# EAGLE design Adafruit 2.7in Tri-Color eInk Display (EAGLE 9.2.0)
COMPANY: ADAFRUIT INDUSTRIES; DRAWN: K. TOWNSEND; REV: A
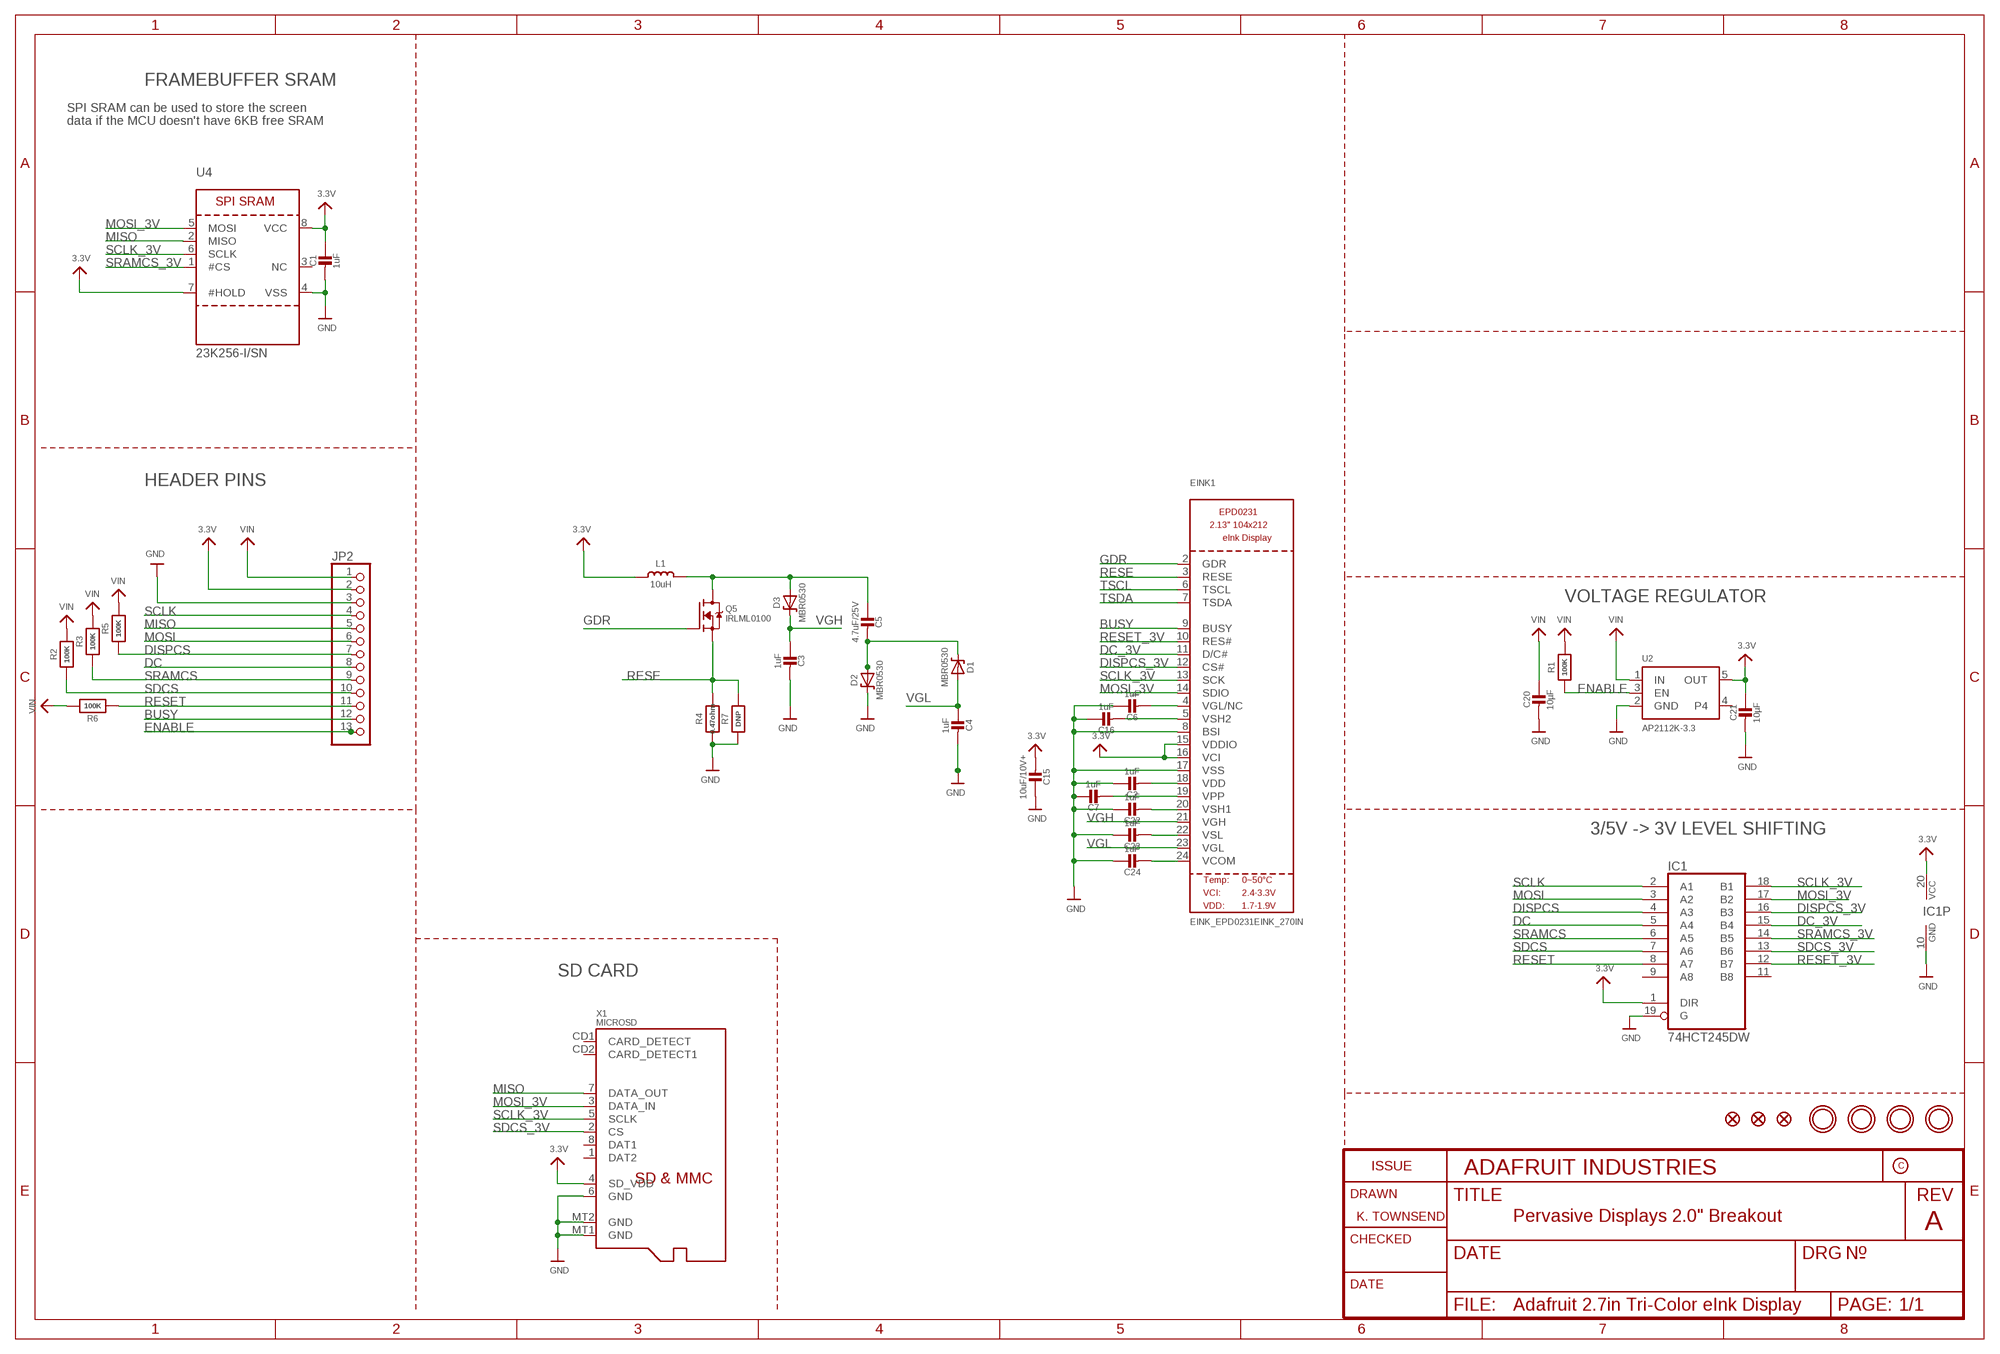
[diagram p0: schematic, sheet 1]

## Parts
C1  1uF  CAP_CERAMIC0805_10MGAP  [0805_10MGAP]
C2  1uF  CAP_CERAMIC0805-NOOUTLINE  [0805-NO]
C3  1uF  CAP_CERAMIC0805-NOOUTLINE  [0805-NO]
C4  1uF  CAP_CERAMIC0805-NOOUTLINE  [0805-NO]
C5  4.7uF/25V  CAP_CERAMIC0805-NOOUTLINE  [0805-NO]
C6  1uF  CAP_CERAMIC0805-NOOUTLINE  [0805-NO]
C7  1uF  CAP_CERAMIC0805-NOOUTLINE  [0805-NO]
C15  10uF/10V+  CAP_CERAMIC0805-NOOUTLINE  [0805-NO]
C16  1uF  CAP_CERAMIC0805-NOOUTLINE  [0805-NO]
C20  10µF  CAP_CERAMIC0805-NOOUTLINE  [0805-NO]
C21  10µF  CAP_CERAMIC0805-NOOUTLINE  [0805-NO]
C22  1uF  CAP_CERAMIC0805-NOOUTLINE  [0805-NO]
C23  1uF  CAP_CERAMIC0805-NOOUTLINE  [0805-NO]
C24  1uF  CAP_CERAMIC0805-NOOUTLINE  [0805-NO]
D1  MBR0530  DIODE-SCHOTTKYSOD-123  [SOD-123]
D2  MBR0530  DIODE-SCHOTTKYSOD-123  [SOD-123]
D3  MBR0530  DIODE-SCHOTTKYSOD-123  [SOD-123]
EINK1  EINK_EPD0231EINK_270IN  [EINK_270IN]
FID1  FIDUCIAL_1MM  [FIDUCIAL_1MM]
FID2  FIDUCIAL_1MM  [FIDUCIAL_1MM]
FID3  FIDUCIAL_1MM  [FIDUCIAL_1MM]
IC1  74HCT245DW  [SO20W]
JP2  HEADER-1X13  [1X13_ROUND_70]
L1  10uH  INDUCTORNR401  [INDUCTOR_4X4MM_NR401]
Q5  IRLML0100  IRLML2060TRPBF  [SOT23-3]
R1  100K  RESISTOR0805_NOOUTLINE  [0805-NO]
R2  100K  RESISTOR0805_NOOUTLINE  [0805-NO]
R3  100K  RESISTOR0805_NOOUTLINE  [0805-NO]
R4  0.47ohm  RESISTOR0805_10MGAP  [0805_10MGAP]
R5  100K  RESISTOR0805_NOOUTLINE  [0805-NO]
R6  100K  RESISTOR0805_NOOUTLINE  [0805-NO]
R7  DNP  RESISTOR0805_10MGAP  [0805_10MGAP]
U2  AP2112K-3.3  VREG_SOT23-5  [SOT23-5]
U4  23K256-I/SN  SRAM_SPI_SOIC8  [SOIC8_150MIL]
U$3  MOUNTINGHOLE2.5  [MOUNTINGHOLE_2.5_PLATED]
U$4  MOUNTINGHOLE2.5  [MOUNTINGHOLE_2.5_PLATED]
U$5  MOUNTINGHOLE2.5  [MOUNTINGHOLE_2.5_PLATED]
U$6  MOUNTINGHOLE2.5  [MOUNTINGHOLE_2.5_PLATED]
X1  MICROSD  [MICROSD]

## Nets
3.3V: C1.1 C15.2 C21.1 EINK1.15(VDDIO) EINK1.16(VCI) IC1.1(DIR) IC1.20(VCC) JP2.2 L1.P$2 U2.5(OUT) U4.7(#HOLD) U4.8(VCC) X1.4(SD_VDD)
BUSY: EINK1.9(BUSY) JP2.12
DC: IC1.5(A4) JP2.8
DC_3V: EINK1.11(D/C#) IC1.15(B4)
DISPCS: IC1.4(A3) JP2.7 R5.1
DISPCS_3V: EINK1.12(CS#) IC1.16(B3)
ENABLE: JP2.13 R1.1 U2.3(EN)
GDR: EINK1.2(GDR) Q5.1(G)
GND: C1.2 C2.1 C3.2 C4.2 C6.1 C7.1 C15.1 C16.1 C20.2 C21.2 C22.1 C23.1 C24.1 D2.C EINK1.8(BSI) EINK1.17(VSS) IC1.10(GND) IC1.19(G) JP2.3 R4.2 R7.2 U2.2(GND) U4.4(VSS) X1.6(GND) X1.MT1(GND) X1.MT2(GND)
MISO: JP2.5 U4.2(MISO) X1.7(DATA_OUT)
MOSI: IC1.3(A2) JP2.6
MOSI_3V: EINK1.14(SDIO) IC1.17(B2) U4.5(MOSI) X1.3(DATA_IN)
N$1: C7.2 EINK1.19(VPP)
N$2: C5.2 D1.C D2.A
N$3: C5.1 D3.A L1.P$1 Q5.3(D)
N$4: C16.2 EINK1.5(VSH2)
N$5: C2.2 EINK1.18(VDD)
N$6: C22.2 EINK1.20(VSH1)
N$9: C6.2 EINK1.4(VGL/NC)
N$27: C23.2 EINK1.22(VSL)
N$33: C24.2 EINK1.24(VCOM)
RESE: EINK1.3(RESE) Q5.2(S) R4.1 R7.1
RESET: IC1.8(A7) JP2.11 R6.1
RESET_3V: EINK1.10(RES#) IC1.12(B7)
SCLK: IC1.2(A1) JP2.4
SCLK_3V: EINK1.13(SCK) IC1.18(B1) U4.6(SCLK) X1.5(SCLK)
SDCS: IC1.7(A6) JP2.10 R2.1
SDCS_3V: IC1.13(B6) X1.2(CS)
SRAMCS: IC1.6(A5) JP2.9 R3.1
SRAMCS_3V: IC1.14(B5) U4.1(#CS)
TSCL: EINK1.6(TSCL)
TSDA: EINK1.7(TSDA)
VGH: C3.1 D3.C EINK1.21(VGH)
VGL: C4.1 D1.A EINK1.23(VGL)
VIN: C20.1 JP2.1 R1.2 R2.2 R3.2 R5.2 R6.2 U2.1(IN)
Unconnected: IC1.9(A8) IC1.11(B8) U2.4 U4.3(NC) X1.1(DAT2) X1.8(DAT1) X1.CD1(CARD_DETECT) X1.CD2(CARD_DETECT1)

## Notes on the sheet
- FRAMEBUFFER SRAM
- SPI SRAM can be used to store the screen
- data if the MCU doesn't have 6KB free SRAM
- HEADER PINS
- VOLTAGE REGULATOR
- 3/5V -> 3V LEVEL SHIFTING
- SD CARD
- Pervasive Displays 2.0" Breakout

## Library data of the parts
C1-C7 C15 C16 C20-C24 = microbuilder:CAP_CERAMIC: Ceramic Capacitors For new designs, use the packages preceded by an '_' character since they are more reliable: The following footprints should be used on most boards: _0402 - Standard footprint for regular board layouts _0603 - Standard footprint for regular board layouts _0805 - Standard footprint for regular board layouts _1206 - Standard footprint for regular board layouts For extremely tight-pitch boards where space is at a premium, the following 'micro-pitch' footprints can be used (smaller pads, no silkscreen outline, etc.): _0402MP - Micro-pitch footprint for very dense/compact boards _0603MP - Micro-pitch footprint for very dense/compact boards _0805MP - Micro-pitch footprint for very dense/compact boards _1206MP - Micro-pitch footprint for very dense/compact boards
D1-D3 = microbuilder:DIODE-SCHOTTKY
EINK1 = microbuilder:EINK_EPD0231
FID1-FID3 = microbuilder:FIDUCIAL: Fiducial Alignment Points Various fiducial points for machine vision alignment.; BOM: EXCLUDE
IC1 = 74xx-eu:74*245: Octal BUS TRANSCEIVER, 3-state
JP2 = microbuilder:HEADER-1X13
L1 = microbuilder:INDUCTOR: Inductors 0603: 10nH Ceramic Inductor - microwire antenna/RF (Digikey: 712-1434-2-ND) 0805: 560nH Ceramic Inductor - RF (Digikey: 553-1047-1-ND) 270nH Ceramic Inductor - Q = 40@250MHz, +-5%, 1 Ohm DC Resistance (Digikey: 535-10506-2-ND) 1007 (2518 Metric) SMT: 10µH 10% 250mOhm 820mA 1007 Inductor (Digikey: 587-2189-1-ND) 22µH 10% 500mOhm 580mA 1007 Inductor (Digikey: 587-2190-1-ND) 47µH 10% 950mOhm 420mA 1007 Inductor (Digikey: 587-2191-1-ND) 47µH 5% 100mOhm 1A 1008 Inductor (Digikey: 732-1816-1-ND) 5.0x5.0mm (Taiyo Yuden NR5040 Series) 6.8µH 20% 2.3A 64mOhm Inductor (Digikey: 587-2374-2-ND) 5.0x5.0mm (TDK VLC5045 Series) 4.7µH 20% 3.3A 34mOhm Inductor (Digikey: 445-6526-1-ND) 6.8µH 20% 2.7A 46mOhm Inductor (Digikey: 445-6527-1-ND) 6.0x6.0mm (TDK VLC6045 Series) 4.7µH 20% 3.8A 27mOhm Inductor (Digikey: 445-6538-2-ND) 6.8µH 20% 3A 41mOhm Inductor (Digikey: 445-6540-1-ND) 6.2µH 30% 2.2A 45mOhm Inductor (Digikey: SRR5028-6R2YCT-ND) - Not TDK VLC6045 but footprint should match 6.0x6.0mm (TDK SLF6045 Series) 6.8uH 30% 2A 33mOhm Inductor (Digikey: 445-4572-1-ND, Mouser: 810-SLF645T6R8N2R0PF) 6.0x6.0mm (Sumida CDRH5D28 Series) 6.2uH 30% 1.8A 45mOhm Inductor (Digikey: 308-1542-1-ND) Taiyo Yuden NR3015T2R2M - 2.2uH 20% 1.5A (Digikey: 587-1648-2-ND, Mouser: 963-NR3015T2R2M) - Used with TI TPS62172 CoilCraft RFID Transponder Coil - MA5532-AE (For use with AS3935 Lightning Sensor) Taiyo Yuden NRH2412T2R2MNGH - 2.2uH 20% 1AA (Digikey: 587-3443-1-ND) - Used with TI LM3671 Vishay IHLP 1.0uH Molded Inductor - 24mOhm DCR, 5A, +/-20%, -55°C-125°C (Digikey: 541-1319-1-ND)
Q5 = Parts:IRLML2060TRPBF
R1-R7 = microbuilder:RESISTOR: Resistors For new designs, use the packages preceded by an '_' character since they are more reliable: The following footprints should be used on most boards: _0402 - Standard footprint for regular board layouts _0603 - Standard footprint for regular board layouts _0805 - Standard footprint for regular board layouts _1206 - Standard footprint for regular board layouts For extremely tight-pitch boards where space is at a premium, the following 'micro-pitch' footprints can be used (smaller pads, no silkscreen outline, etc.): _0402MP - Micro-pitch footprint for very dense/compact boards _0603MP - Micro-pitch footprint for very dense/compact boards _0805MP - Micro-pitch footprint for very dense/compact boards _1206MP - Micro-pitch footprint for very dense/compact boards
U2 = microbuilder:VREG_SOT23-5: SOT23-5 Fixed Voltage Regulators Part Current Out V Out V In V Dropout θJA (°C/W) TJ (°C) Digikey Part No. ADP121 150mA 3.3V 3.4-5.5V 0.09V @ 150mA -- -- ADP121-AUJZ33R7CT-ND ADP121 150mA 3.0V 3.1-5.5V 0.09V @ 150mA -- -- ADP121-AUJZ30R7CT-ND ADP122 300mA 3.3V 3.4-5.5V 0.085V @ 300mA -- -- ADP122AUJZ-3.3-R7CT-ND ADP1712 300mA 3.3V 3.5-5.5V 0.17V @ 300mA -- -- ADP1712AUJZ-3.3-R7TR-ND AP7311 (Low Cost) 150mA 3.3V 3.5-6V 0.15V @ 150mA -- -- AP7311-33WG-7DICT-ND LD39015M18R 150mA 1.8V 1.9V-5.5V 0.08V @ 100mA -- -- 497-6977-1-ND LP2985A-33DBVR 150mA 3.3V 3.3-16V 0.28V @ 150mA 206 150 296-18479-1-ND MCP1824T-3302E/OT 300mA 3.3V 3.5V-6V 0.2V @ 300mA -- -- MCP1824T-3302E/OTCT-ND MIC5205-2.5YM5 TR 150mA 2.5V 2.7-16V 0.165V @ 150mA -- -- 576-1257-2-ND MIC5205-3.0YM5 TR 150mA 3.0V 3.2V-16V 0.165V @ 150mA -- -- 576-1258-2-ND MIC5205-3.3YM5 TR 150mA 3.3V 3.5V-16V 0.165V @ 150mA -- -- 576-1259-2-ND TPS780330220 150mA 3.3V+2.2V 3.6-5.5V 250mV Max -- -- 296-23332-1-ND TDA3663/N1,135 100mA 3.3V 3.5-45V 0.18V @ 50mA -- -- 568-5343-1-ND Max operating temp can be calculated using θJA, TJ (max junction temperature), and power in watts. Set the "Maximum Ambient Temperature" until it reaches TJ ("Max Junction Temperature"), which is the absolute limit for safe use of the regulator: Heat Sink Temperature Calculator <http://www.daycounter.com/Calculators/Heat-Sink-Temperature-Calculator.phtml> For example, With 12V source into a 3.3V LP2985 and a 30mA load, we are dissipating (12V-3.3V) * 0.03A = 0.261W. With a θJA of 206 °C/W, a TJ of 150°C, and 261mW we can safely use the chip without a heat sink up to 75°C (=147.1°C Junction Temperature).
U4 = microbuilder:SRAM_SPI_SOIC8: SRAM - 8-Pin SPI Interface 23K640-I/SN - 8KB (64Kb), 20MHz, 2.7-3.6V 23K256-I/SN - 32KB (256Kb), 20MHz, 2.7-3.6V 23LC512-I/SN - 64KB (512Kb), 20MHz, 2.7-3.6V
U$3-U$6 = microbuilder:MOUNTINGHOLE: Mounting Hole For #2 screws (0.086"/2.18mm width, 0.094"/2.4mm hole) use 2.5mm; BOM: EXCLUDE
X1 = microbuilder:MICROSD: MicroSD/Transflash Card Holder with SPI pinout 3M: 2908-05WB-MG 4UConnector: 19656 Footprint courtesy: Adafruit Industries

## Board
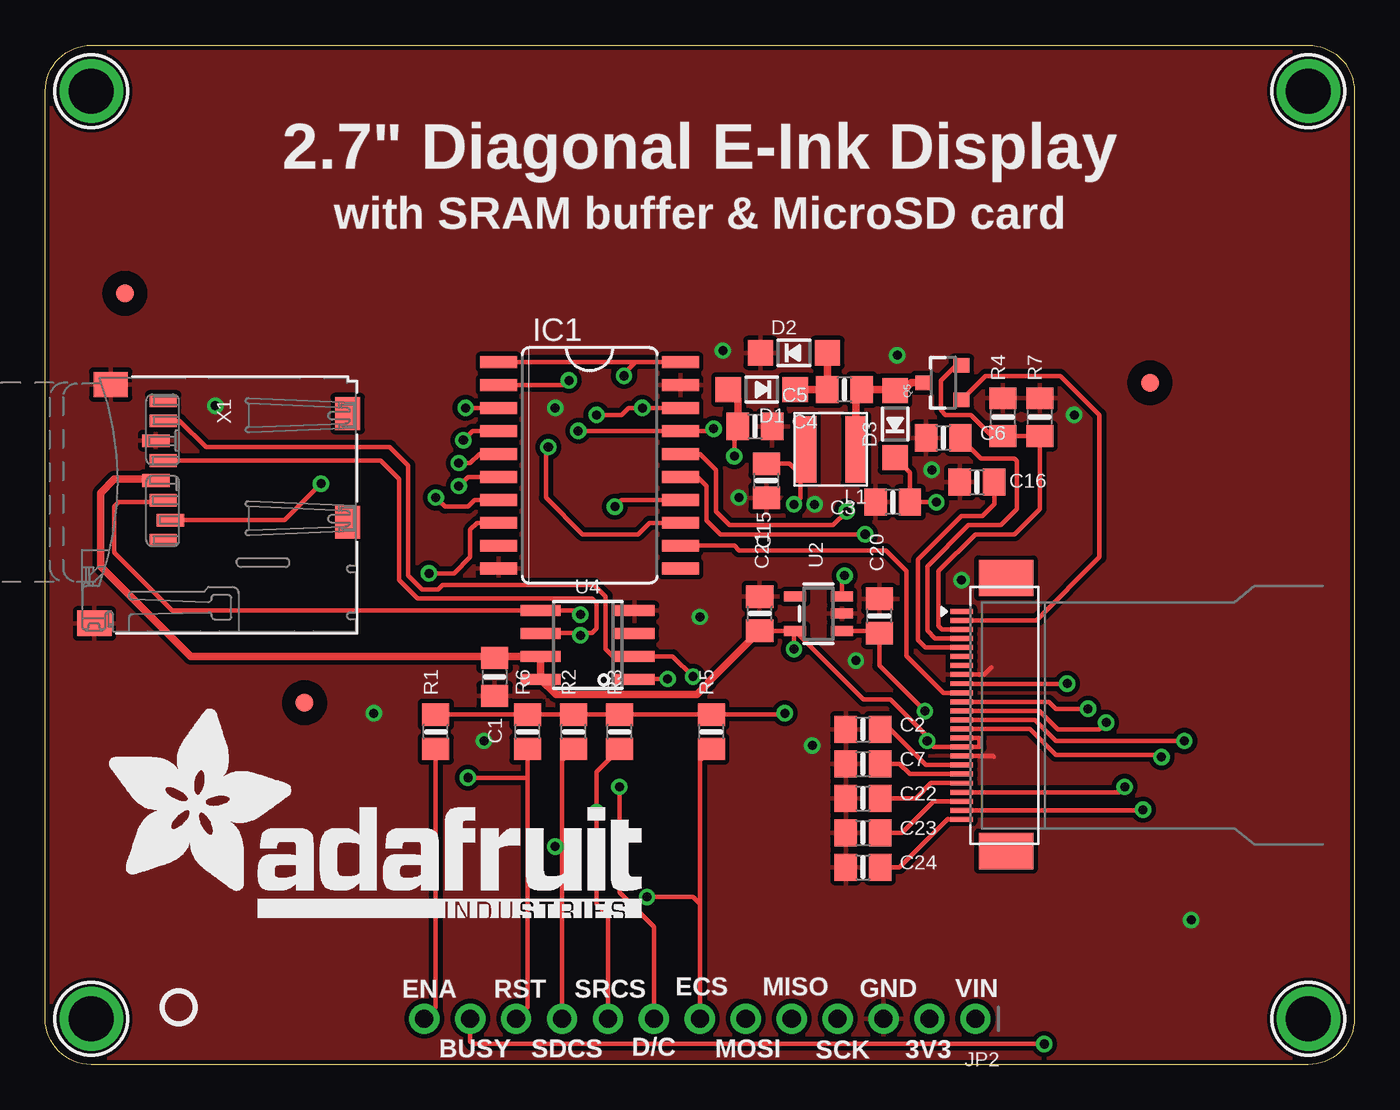
[diagram p1: board, top side]
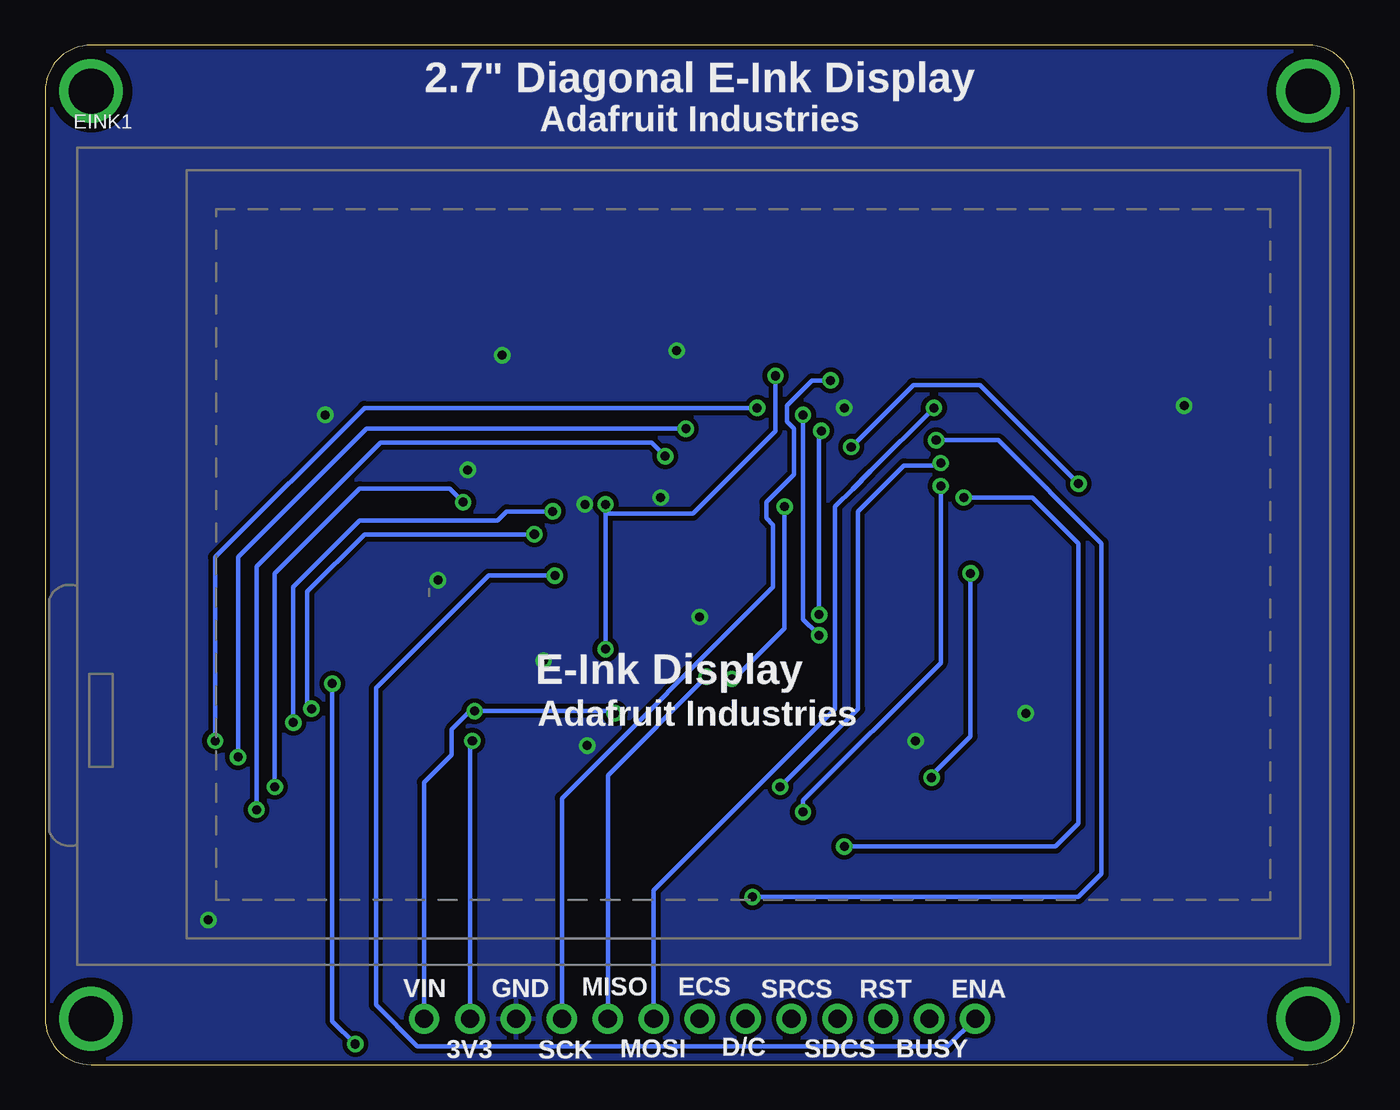
[diagram p2: board, bottom side, seen from below]

Size 72.4 x 56.39 mm. Coordinates in mm from the lower left corner, seen from the top.
Outline: 2.55,56.39 69.86,56.39 arc-90 72.4,53.85 72.4,2.54 arc-90 69.86,0 2.54,0 arc-90 0,2.53 0.01,53.85 arc-90 2.55,56.39
Copper layers (1*16): Top 0.035mm / dielectric 1.5mm / Bottom 0.035mm
Design rules "adafruit *": minimum track width 8mil, minimum drill 15.5mil, track to track 8mil, track to pad 8mil, pad to pad 8mil, via to via 8mil, smd to smd 8mil, copper to edge 10mil, drill to drill 8mil, minimum pad ring 10mil, minimum via ring 8mil, stop-mask expansion 2mil, vias tented up to drill 20mil, thermal gap 10mil

### Footprints (pad centres in the part's own frame; a part is rotated, then mirrored left to right if it is on the bottom)
0805_10MGAP = smd 1.2 x 1.5: 1 -1.05,0; 2 1.05,0
0805-NO = smd 1.24 x 1.5: 1 -0.95,0; 2 0.95,0
SOD-123 = smd 1.4 x 1.4: A 1.85,0; C -1.85,0
EINK_270IN = smd 1.25 x 0.275 bottom: 1 12.26,-22.25; 2 12.26,-22.75; 3 12.26,-23.25; 4 12.26,-23.75; 5 12.26,-24.25; 6 12.26,-24.75; 7 12.26,-25.25; 8 12.26,-25.75; 9 12.26,-26.25; 10 12.26,-26.75; 11 12.26,-27.25; 12 12.26,-27.75; 13 12.26,-28.25; 14 12.26,-28.75; 15 12.26,-29.25; 16 12.26,-29.75; 17 12.26,-30.25; 18 12.26,-30.75; 19 12.26,-31.25; 20 12.26,-31.75; 21 12.26,-32.25; 22 12.26,-32.75; 23 12.26,-33.25; 24 12.26,-33.75 | smd 3 x 2 bottom: SPRT1 9.8,-20.4; SPRT2 9.8,-35.51
FIDUCIAL_1MM = smd 1 x 1: 1 0,0
SO20W = smd 0.66 x 2.032: 1 -5.715,-5.029; 2 -4.445,-5.029; 3 -3.175,-5.029; 4 -1.905,-5.029; 5 -0.635,-5.029; 6 0.635,-5.029; 7 1.905,-5.029; 8 3.175,-5.029; 9 4.445,-5.029; 10 5.715,-5.029; 11 5.715,5.029; 12 4.445,5.029; 13 3.175,5.029; 14 1.905,5.029; 15 0.635,5.029; 16 -0.635,5.029; 17 -1.905,5.029; 18 -3.175,5.029; 19 -4.445,5.029; 20 -5.715,5.029
1X13_ROUND_70 = drill 1 pad 1.676: 1 -15.24,0; 2 -12.7,0; 3 -10.16,0; 4 -7.62,0; 5 -5.08,0; 6 -2.54,0; 7 0,0; 8 2.54,0; 9 5.08,0; 10 7.62,0; 11 10.16,0; 12 12.7,0; 13 15.24,0
INDUCTOR_4X4MM_NR401 = smd 1.2 x 3.7: P$1 -1.4,0; P$2 1.4,0
SOT23-3 = smd 0.8 x 0.9: 1 -0.95,-1; 2 0.95,-1; 3 0,1.1
SOT23-5 = smd 0.55 x 1.2: 1 -0.95,-1.3; 2 0,-1.3; 3 0.95,-1.3; 4 0.95,1.3; 5 -0.95,1.3
SOIC8_150MIL = smd 0.6 x 2.2: 1 -1.905,-2.6; 2 -0.635,-2.6; 3 0.635,-2.6; 4 1.905,-2.6; 5 1.905,2.6; 6 0.635,2.6; 7 -0.635,2.6; 8 -1.905,2.6
MOUNTINGHOLE_2.5_PLATED = drill 2.5 pad 3.2: P$1 0,0
MICROSD = smd 0.7 x 1.5: 1 9,-10.64; 2 7.9,-10.24; 3 6.8,-10.64; 4 5.7,-11.04; 5 4.6,-10.64; 6 3.5,-11.04; 7 2.4,-10.64; 8 1.3,-10.64 | smd 1.8 x 1.4: CD1 2,-0.44; CD2 8,-0.44 | smd 1.4 x 1.9: MT1 0.4,-13.54; MT2 13.6,-14.44

### Placement (x,y rotation side)
C1  24.85,21.44 270 top
C2  45.22,18.54 0 top
C3  46.87,31.11 180 top
C4  39.25,35.31 0 top
C5  44.21,37.34 180 top
C6  49.67,34.67 0 top
C7  45.22,16.64 0 top
C15  39.88,32.3 90 top
C16  51.53,32.22 0 top
C20  46.13,24.82 90 top
C21  39.52,24.94 90 top
C22  45.22,14.73 0 top
C23  45.22,12.83 0 top
C24  45.22,10.92 0 top
D1  39.63,37.34 180 top
D2  41.41,39.37 0 top
D3  47,35.43 90 top
EINK1  62.94,47.32 0 bottom
FID1  4.41,42.66 0 top
FID2  14.35,20.02 90 top
FID3  61.1,37.72 0 top
IC1  30.11,33.15 270 top
JP2  36.21,2.54 180 top
L1  43.44,34.04 180 top
Q5  49.67,37.72 90 top
R1  21.6,18.41 90 top
R2  29.22,18.41 90 top
R3  31.76,18.41 90 top
R4  52.97,35.81 90 top
R5  36.84,18.41 90 top
R6  26.68,18.41 90 top
R7  55,35.81 90 top
U2  42.76,24.94 90 top
U4  30,23.22 90 top
U$3  69.86,2.54 0 top
U$4  2.55,2.54 0 top
U$5  69.86,53.85 0 top
U$6  2.55,53.85 0 top
U$9  [PCBFEAT-REV-040]  7.38,3.17 0 top
U$39  [ADAFRUIT_TEXT_30MM]  3.31,8.13 0 top
X1  17.16,38.01 270 top

### Tracks (layer width: path | path; a pad name or v marks a point on that pad's centre or on a via)
3.3V  (via drill 0.5)
  Top 0.254: 32.65,38.86 IC1.1 | IC1.20 32.65,38.86 | C15.2 41.15,33.25 41.76,32.64 41.76,31.34 v41.41,30.99 | U2.5 C21.1 | U2.5 39.53,23.99 | U2.5 45.26,20.19 46.75,20.19 48.78,18.16 v48.78,17.91 49.11,17.57 EINK1.16 51.68,17.57 51.68,18.06 51.67,18.07 EINK1.15 | v41.41,22.99 41.41,23.94 U2.5 | 32.65,38.86 32.01,38.23 v32.01,38.1 | C1.1 24.85,22.59
  Top 0.406: L1.P$2 41.76,33.75 41.76,32.64 | U4.7 27.39,22.59 | 24.85,22.59 C1.1 | 24.85,22.59 8.03,22.59 3.06,27.56 3.06,31.62 3.82,32.38 6.05,32.38 X1.4 | C21.1 36.68,21.16 36.68,21.11 36.05,20.48 28.24,20.48 U4.8 U4.7 | U4.7 24.85,22.59
  Bottom 0.254: v41.41,30.99 41.41,30.48 | 41.41,30.48 v41.41,22.99 | v32.01,38.1 32.01,35.05 36.59,30.48 41.41,30.48 | JP2.2 48.91,17.78 v48.78,17.91
BUSY  (via drill 0.5)
  Top 0.254: v55.26,1.14 23.63,1.14 23.51,1.27 JP2.12 | EINK1.9 56.52,21.07 v56.53,21.08
  Bottom 0.254: v56.53,21.08 56.53,2.41 v55.26,1.14
DC  (via drill 0.5)
  Top 0.254: IC1.5 24.01,33.78 23.51,33.27 v22.87,33.27 | v31.76,15.37 31.76,9.53 33.67,7.62 JP2.8
  Bottom 0.254: 23,33.27 v22.87,33.27 23,33.15 24.9,33.15 27.44,30.61 27.44,19.68 v31.76,15.37
DC_3V  (via drill 0.5)
  Top 0.254: v57.67,19.68 55.89,19.68 55.5,20.07 EINK1.11 | v45.35,29.34 37.35,29.34 36.59,30.1 36.59,32 36.08,32.51 IC1.15
  Bottom 0.254: v45.35,29.34 54.75,29.34 57.92,26.16 57.92,19.94 v57.67,19.68
DISPCS  (via drill 0.5)
  Top 0.254: IC1.4 23.63,35.05 v23.12,34.54 | R5.1 36.21,16.83 36.21,8.89 | 36.21,8.89 JP2.7 | 36.21,8.89 35.82,9.27 v33.28,9.27
  Bottom 0.254: 23.25,34.54 v23.12,34.54 19.7,34.54 13.98,28.83 13.98,10.54 15.25,9.27 v33.28,9.27
DISPCS_3V  (via drill 0.5)
  Top 0.254: IC1.16 36.21,33.78 37.09,32.89 37.09,30.61 37.86,29.84 43.57,29.84 v44.33,30.61 | v58.68,18.92 58.3,18.54 56.02,18.54 54.99,19.57 EINK1.12
  Bottom 0.254: v58.68,18.92 58.68,26.42 55,30.1 47.38,30.1 46.87,30.61 v44.33,30.61
ENABLE  (via drill 0.5)
  Top 0.254: v44.21,27.05 44.06,26.91 U2.3 | R1.1 21.6,3.17 JP2.13
  Bottom 0.254: JP2.13 22.49,1.02 51.83,1.02 54.11,3.3 54.11,20.83 47.89,27.05 v44.21,27.05
GDR
  Top 0.254: Q5.1 52,38.1 56.14,38.1 58.3,35.94 58.3,28.07 54.81,24.57 52.08,24.57 51.68,24.57 EINK1.2
GND  (via drill 0.5)
  Top 0.254: 52.33,21.97 51.94,21.57 EINK1.8 | 52.46,17.02 52.41,17.07 EINK1.17
  other vias: 37.48,39.5 47.13,39.24 36.21,24.77 44.84,22.35 50.68,26.8 38.36,31.37 49.03,32.89 42.43,17.65 18.17,19.43 9.41,36.45 63.38,8 24.27,17.91 28.2,36.32 42.56,30.99 56.91,35.94
  pour Top (isolate 0.254): 0.01,56.64 72.4,56.64 72.4,0 0.01,0
  pour Bottom (isolate 0.254): 0.01,56.64 72.4,56.64 72.4,0 0.01,0
MISO  (via drill 0.5)
  Top 0.254: X1.7 7.45,35.61 8.9,34.16 19.06,34.16 20.08,33.15 20.08,27.05 20.84,26.29 21.73,26.29 21.98,26.54 30.36,26.54 31,25.91 31,22.99 31.4,22.59 U4.2 34.7,22.59 v35.82,21.46
  Bottom 0.254: JP2.5 41.29,16 v35.82,21.46
MOSI  (via drill 0.5)
  Top 0.254: IC1.3 v23.25,36.32
  Bottom 0.254: 26.81,32.77 v23.25,36.32 | 27.7,31.88 28.71,30.86 28.71,19.68 38.75,9.65 JP2.6
  Bottom 0.305: 27.7,31.88 26.81,32.77
MOSI_3V  (via drill 0.5)
  Top 0.254: v36.97,35.18 36.84,35.05 IC1.17 v29.47,35.05 | v61.73,17.02 61.61,17.14 55.89,17.14 54.46,18.57 EINK1.14 | v29.6,24.89 29.37,25.12 U4.5 7.02,25.12 3.82,28.32 3.82,30.86 4.07,31.11 6.43,31.11 X1.3 | EINK1.14
  Bottom 0.254: v36.97,35.18 54.62,35.18 61.73,28.07 v61.73,17.02 | v29.6,24.89 29.6,34.92 v29.47,35.05
N$1
  Top 0.254: C7.2 47.25,16.64 47.82,16.07 49.54,16.07 49.77,16.07 EINK1.19
N$2
  Top 0.406: D2.A C5.2 D1.C
N$3
  Top 0.406: L1.P$1 44.84,37.03 C5.1 46.95,37.34 D3.A 47.48,37.28 47.92,37.72 Q5.3
N$4
  Top 0.254: C16.2 52.48,31.01 51.83,30.35 50.68,30.35 48.27,27.94 48.27,23.5 48.69,23.07 EINK1.5
N$5
  Top 0.254: C2.2 46.3,18.67 46.62,18.67 48.72,16.57 EINK1.18
N$6
  Top 0.254: C22.2 48.14,14.73 48.98,15.57 49.54,15.57 49.77,15.57 EINK1.20
N$9
  Top 0.254: C6.2 51.76,33.53 53.6,33.53 53.73,33.4 53.73,30.73 52.84,29.84 51.06,29.84 48.78,27.56 48.78,24 49.21,23.57 49.54,23.57 49.77,23.57 EINK1.4
N$27
  Top 0.254: C23.2 47.38,12.83 49.13,14.57 EINK1.22
N$33
  Top 0.254: C24.2 47.25,10.92 49.92,13.58 49.93,13.57 EINK1.24
RESE
  Top 0.254: Q5.2 50.36,38.67 49.54,37.85 49.54,36.2 49.79,35.94 51.19,35.94 52.37,34.76 R4.1 | R7.1 R4.1 | R7.1 R4.1 | EINK1.3 49.6,24.07 49.41,24.26 49.41,27.3 51.45,29.34 53.6,29.34 55,30.73 R7.1 | R7.1
RESET  (via drill 0.5)
  Top 0.254: IC1.8 23.89,29.97 23.51,29.59 23.51,28.07 22.62,27.18 v21.22,27.18 | R6.1 26.68,15.88 | 26.68,15.88 26.68,3.17 JP2.11 | v23.38,15.88 26.68,15.88
  Bottom 0.254: v23.38,15.88 23.38,16 21.22,18.16 v21.22,27.18
RESET_3V
  Top 0.254: IC1.12 38.11,28.7 38.36,28.45 46.49,28.45 47.64,27.3 47.64,22.61 49.67,20.57 49.77,20.57 EINK1.10
SCLK  (via drill 0.5)
  Top 0.254: IC1.2 28.71,37.59 v28.97,37.85
  Bottom 0.254: v28.97,37.85 29.98,37.85 31.38,36.45 31.38,35.56 31,35.18 31,32.64 32.52,31.11 32.52,30.23 32.14,29.84 32.14,26.42 43.83,14.73 JP2.4
SCLK_3V  (via drill 0.5)
  Top 0.254: 29.47,23.88 30.24,23.88 30.49,24.13 30.49,25.53 30.24,25.78 20.58,25.78 19.57,26.8 19.57,32.38 18.54,33.41 X1.5 | U4.6 27.42,23.88 29.47,23.88 | IC1.18 32.27,36.32 31.89,35.94 v30.49,35.94 | 35.82,36.32 IC1.18 | IC1.18 v33.03,36.32 | v63,17.91 55.89,17.91 54.73,19.07 EINK1.13 | v29.6,23.75 29.47,23.88 | X1.5
  Bottom 0.254: v63,17.91 63,28.07 54.75,36.32 v33.03,36.32 | v29.6,23.75 29.73,23.75 29.73,23.88 30.49,24.64 v30.49,35.94
SDCS  (via drill 0.5)
  Top 0.254: 21.73,31.24 v21.6,31.37 22.11,30.86 23.38,30.86 23.76,31.24 IC1.7 | R2.1 28.59,16.83 28.59,12.06 | 28.59,12.06 JP2.10 | v28.2,12.06 28.59,12.06
  Bottom 0.254: v21.6,31.37 17.79,31.37 15.25,28.83 15.25,13.34 16.52,12.06 v28.2,12.06
SDCS_3V  (via drill 0.5)
  Top 0.254: IC1.13 33.41,29.97 32.78,29.34 29.73,29.34 27.7,31.37 27.7,34.04 v27.82,34.16 | X1.2 13.23,30.11 v15.25,32.13
  Bottom 0.254: v27.82,34.16 24.39,37.59 20.71,37.59 v15.25,32.13
SRAMCS  (via drill 0.5)
  Top 0.254: IC1.6 23.38,32.51 v22.87,32 | R3.1 30.49,16.2 v30.49,13.97 30.49,8.89 31.13,8.26 JP2.9
  Bottom 0.254: v22.87,32 22.87,22.23 30.49,14.61 v30.49,13.97
SRAMCS_3V  (via drill 0.5)
  Top 0.254: v31.51,30.86 31.89,31.24 IC1.14 | U4.1 32.62,21.34 v34.43,21.34
  Bottom 0.254: v31.51,30.86 31.51,24.13 34.3,21.34 v34.43,21.34
VGH  (via drill 0.5)
  Top 0.254: D3.C 47.82,32.76 C3.1 v49.29,31.11 | EINK1.21 59.41,15.07 v59.7,15.37
  Bottom 0.254: v49.29,31.11 50.05,31.88 55,31.88 59.7,27.18 v59.7,15.37
VGL  (via drill 0.5)
  Top 0.254: 37.8,37.33 D1.A | v38.11,33.66 38.11,35.11 C4.1 | v60.72,14.1 60.69,14.07 EINK1.23
  Top 0.406: 37.8,37.33 38.3,36.82 C4.1 38.49,35.12
  Bottom 0.254: v60.72,14.1 60.72,27.56 53.86,34.42 38.87,34.42 v38.11,33.66
VIN  (via drill 0.5)
  Top 0.254: R1.2 R6.2 R2.2 R3.2 R5.2 40.84,19.36 v40.9,19.43 | U2.1 46.13,23.99 C20.1 46.13,22.08 v48.65,19.56
  Bottom 0.254: JP2.1 51.45,15.62 49.92,17.14 49.92,18.54 48.91,19.56 v48.65,19.56 41.03,19.56 v40.9,19.43

### Text on the board
tPlace: 2.7" Diagonal E-Ink Display | with SRAM buffer & MicroSD card | ENA | RST | SRCS | ECS | MISO | GND | VIN | BUSY | SDCS | D/C | MOSI | SCK | 3V3
bPlace: 2.7" Diagonal E-Ink Display | Adafruit Industries | E-Ink Display | Adafruit Industries | ENA | RST | SRCS | ECS | MISO | GND | VIN | BUSY | SDCS | D/C | MOSI | SCK | 3V3